# Altium schematic sheet Schematic.SchDoc
size A4; SheetNumber: 1; SheetTotal: 1
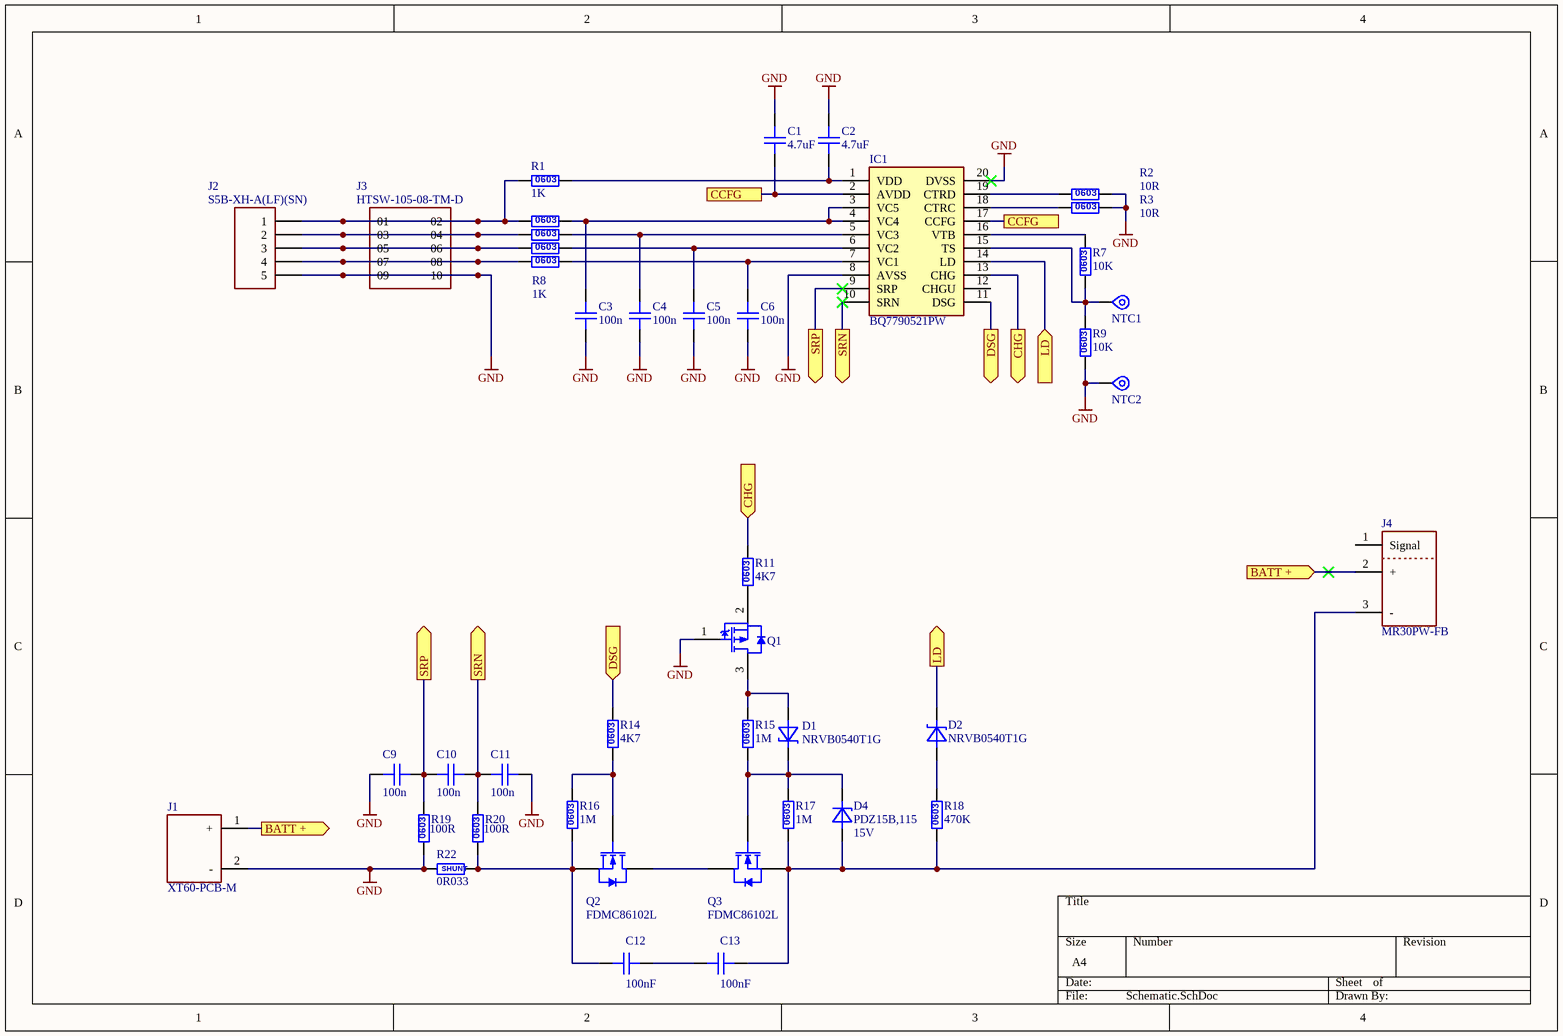
[diagram p0: Schematic.SchDoc]

## Parts
C1  value 4.7uF  [C3216_Commercial]  (hidden comment: GRM31CC72A475ME11L)
C2  value 4.7uF  [C3216_Commercial]  (hidden comment: GRM31CC72A475ME11L)
C3  value 100n  [C0603]  (hidden comment: 06035C104K4Z2A)
C4  value 100n  [C0603]  (hidden comment: 06035C104K4Z2A)
C5  value 100n  [C0603]  (hidden comment: 06035C104K4Z2A)
C6  value 100n  [C0603]  (hidden comment: 06035C104K4Z2A)
C9  value 100n  [C0603]  (hidden comment: 06035C104K4Z2A)
C10  value 100n  [C0603]  (hidden comment: 06035C104K4Z2A)
C11  value 100n  [C0603]  (hidden comment: 06035C104K4Z2A)
C12  value 100nF  [C3216_Commercial]  (hidden comment: GRT31C5C2A104JA12L)
C13  value 100nF  [C3216_Commercial]  (hidden comment: GRT31C5C2A104JA12L)
D1  NRVB0540T1G  [SOD323]
D2  NRVB0540T1G  [SOD323]
D4  PDZ15B,115  value 15V  [SOD323]
IC1  BQ7790521PW  [SOP65P640X120-20N]
J1  XT60-PCB-M  [XT60-PCB-M]
J2  S5B-XH-A(LF)(SN)  [JST_S5B-XH-A(LF)(SN)]
J3  HTSW-105-08-TM-D  [SAMTEC_HTSW-105-08-TM-D]
J4  MR30PW-FB  [MR30PW-FB]
NTC1  TP  [Pad0.8mm MPoint big]  (value not drawn)  (no BOM)
NTC2  TP  [Pad0.8mm MPoint big]  (value not drawn)  (no BOM)
Q1  FDV304P  [FAIR-SOT23-3_V]  (value not drawn)
Q2  FDMC86102L  [PowerPak1212_LFPAK33]
Q3  FDMC86102L  [PowerPak1212_LFPAK33]
R1  value 1K  [R0603]  (hidden comment: ERJ-3EKF1002V)
R2  value 10R  [R0603]  (hidden comment: CR0603-FX-10R0ELF)
R3  value 10R  [R0603]  (hidden comment: CR0603-FX-10R0ELF)
R4  ERJ-3EKF1002V  [R0603]  (value not drawn)
R5  ERJ-3EKF1002V  [R0603]  (value not drawn)
R6  ERJ-3EKF1002V  [R0603]  (value not drawn)
R7  value 10K  [R0603]  (hidden comment: CRGP0603F10K)
R8  value 1K  [R0603]  (hidden comment: ERJ-3EKF1002V)
R9  value 10K  [R0603]  (hidden comment: CRGP0603F10K)
R11  value 4K7  [R0603]  (hidden comment: RC0603FR-074K7L)
R14  value 4K7  [R0603]  (hidden comment: RC0603FR-074K7L)
R15  value 1M  [R0603]  (hidden comment: RC0603JR-071ML)
R16  value 1M  [R0603]  (hidden comment: RC0603JR-071ML)
R17  value 1M  [R0603]  (hidden comment: RC0603JR-071ML)
R18  value 470K  [R0603]  (hidden comment: CRGCQ0603F470K)
R19  value 100R  [R0603]  (hidden comment: RC0603FR-07100RL)
R20  value 100R  [R0603]  (hidden comment: RC0603FR-07100RL)
R22  value 0R033  [Shunt_2512]  (hidden comment: GMR100HTBFMR033)

## Ports
BATT + (in, see Schematic[1D]), BATT + (out, see Schematic[4C]), CCFG (see Schematic[2A]), CCFG (see Schematic[3A]), CHG (in, see Schematic[3B]), CHG (out, see Schematic[2C]), DSG (in, see Schematic[3B]), DSG (out, see Schematic[2C]), LD (in, see Schematic[3C]), LD (out, see Schematic[3B]), SRN (out, see Schematic[2C]), SRN (out, see Schematic[3B]), SRP (out, see Schematic[2C]), SRP (out, see Schematic[3B])

## Nets
GND: C1.2 C2.2 C3.1 C4.1 C5.1 C6.1 C9.1 C11.2 IC1.8(AVSS) IC1.20(DVSS) J1.2(-) J2.5 J3.09 J3.10 NTC2.1 Q1.1(G) R2.1 R3.1 R9.2 R19.2 R22.1
BATT +: J1.1(+) J4.2(+) ; port BATT +
CCFG: C1.1 IC1.2(AVDD) IC1.17(CCFG) ; port CCFG
CHG: IC1.13(CHG) R11.1 ; port CHG
DSG: IC1.11(DSG) R14.1 ; port DSG
LD: D2.2(C) IC1.14(LD) ; port LD
SRN: C10.2 C11.1 IC1.10(SRN) R20.1 ; port SRN
SRP: C9.2 C10.1 IC1.9(SRP) R19.1 ; port SRP
NetC2_1: C2.1 IC1.1(VDD) R1.1
NetC3_2: C3.2 IC1.3(VC5) IC1.4(VC4) R8.1
NetC4_2: C4.2 IC1.5(VC3) R4.1
NetC5_2: C5.2 IC1.6(VC2) R5.1
NetC6_2: C6.2 IC1.7(VC1) R6.1
NetC12_1: C12.1 Q2.1(SOURCE) Q2.2(SOURCE) Q2.3(SOURCE) R16.2 R20.2 R22.2
NetC12_2: C12.2 C13.1
NetC13_2: C13.2 D4.1(A) J4.3(-) Q3.1(SOURCE) Q3.2(SOURCE) Q3.3(SOURCE) R17.2 R18.2
NetD1_1: D1.1(A) Q1.3(D) R15.1
NetD1_2: D1.2(C) D4.2(C) Q3.4(GATE) R15.2 R17.1
NetD2_1: D2.1(A) R18.1
NetIC1_15: IC1.15(TS) NTC1.1 R7.2 R9.1
NetIC1_16: IC1.16(VTB) R7.1
NetIC1_18: IC1.18(CTRC) R3.2
NetIC1_19: IC1.19(CTRD) R2.2
NetJ2_1: J2.1 J3.01 J3.02 R1.2 R8.2
NetJ2_2: J2.2 J3.03 J3.04 R4.2
NetJ2_3: J2.3 J3.05 J3.06 R5.2
NetJ2_4: J2.4 J3.07 J3.08 R6.2
NetQ1_2: Q1.2(S) R11.2
NetQ2_4: Q2.4(GATE) R14.2 R16.1
NetQ2_5: Q2.5(DRAIN) Q3.5(DRAIN)

Not connected (* = marked no-connect by the designer): IC1 12(CHGU); J4 1(Signal)

## Notes on the sheet
- (in symbol CR_0603_100) 0603
- (in symbol CR_0603_101) 0603
- (in symbol CR_0603_102) 0603
- (in symbol CR_0603_103) 0603
- (in symbol CR_0603_105) 0603
- (in symbol CR_0603_472) 0603
- (in symbol CR_0603_474) 0603
- (in symbol SHUNT_2512_0R033) SHUNT

## Library data of the parts
C1 C2 = CC_1206_X7S_475: Capacitor X7S; Supplier 1: Mouser; Supplier 2: Digi-Key; Supplier Part Number 1: 81-GRM31CC72A475ME11; Supplier Part Number 2: 490-18621-6-ND
C3-C6 C9-C11 = CC_0603_X7R_104: Ceramic Capacitor X7R 50V; Part Number: 100n/50V X7R C0603; SMD/THD: SMD; Main: Capacitors; Status: A; Category: Capacitors CERA SMD; Manufacturer Part Number: 100n/50V X7R C0603; Component Type: Capacitors; Supplier 1: Mouser; Supplier 2: Farnell; Supplier Part Number 1: 581-06035C104K4Z2A; Supplier Part Number 2: 1833843
C12 C13 = CC_1206_NP0_104: Capacitor NP0; Supplier 1: Mouser; Supplier 2: Digi-Key; Supplier Part Number 1: 81-GRT31C5C2A104JA2L; Supplier Part Number 2: 490-GRT31C5C2A104JA12LDKR-ND
D1 D2 = NRVB0540T1G: Schottky Diode 40V, 500mA; SMD/THD: SMD; Main: Diodes; Value: NRVB0540T1G; Category: Schottky; Status: A; Supplier 1: Mouser; Supplier Part Number 1: 863-NRVB0540T1G; Supplier 2: Farnell; Supplier Part Number 2: 2723913
D4 = PDZ15B,115: Zener Diode 15V, 400mW; SMD/THD: SMD; Main: Diodes; Category: Zener; Status: A; Supplier 1: Mouser; Supplier Part Number 1: 771-PDZ15B-T/R; Supplier 2: Farnell; Supplier Part Number 2: 1757852; Supplier 3: TME; Supplier Part Number 3: PDZ15B.115
IC1 = BQ7790521PW: 3- to 5-series Li-Ion stackable battery protector; Manufacturer_Name: Texas Instruments; Datasheet Link: https://www.ti.com/lit/ds/symlink/bq77905.pdf?ts=1621687207060&ref_url=https%253A%252F%252Fwww.ti.com%252Fstore%252Fti%252Fen%252Fp%252Fproduct%252F%253Fp%253DBQ7790521PW; Height: 1.2mm; Manufacturer_Part_Number: BQ7790521PW; Mouser Part Number: 595-BQ7790521PW; Mouser Price/Stock: https://www.mouser.co.uk/ProductDetail/Texas-Instruments/BQ7790521PW?qs=bAKSY%2FctAC4iC2ww%2F8Jy9A%3D%3D; Supplier 1: Mouser; Supplier Part Number 1: 595-BQ7790521PWR; Supplier 2: Digi-Key; Supplier Part Number 2: 296-BQ7790521PWRCT-ND; Supplier 3: Texas Instruments; Supplier Part Number 3: BQ7790521PWR
J1 = XT60-PCB-M: XT60 Connector; Manufacturer_Name: Amass; Manufacturer_Part_Number: XT30PB; Datasheet Link: https://www.tme.eu/Document/4acc913878197f8c2e30d4b8cdc47230/XT30UPB%20SPEC.pdf; Height: 10.7mm
J2 = S5B-XH-A(LF)(SN): Connector Header Through Hole, Right Angle 5 position 0.098 _2.50mm_; MF: JST Sales; MP: S5B-XH-A_LF__SN_; SnapEDA_Link: https://www.snapeda.com/parts/S5B-XH-A%28LF%29%28SN%29/JST%20Sales%20America%20Inc./view-part/494428/?ref=snap; Price: None; Package: None; Availability: Unavailable; Value: *
J3 = HTSW-105-08-TM-D: HEADER, 10 CONTACTS, 2 ROWS, THROUGH HOLE, 2.54 MM; Connector Systems:Board-to-Board; Pitch Spacing:2.54mm; No. of Rows:2Rows; No. of Contacts:10Contacts; Contact Termination Type:Through Hole; Product Range:HTSW Series RoHS Compliant: Yes; MP: HTSW10508TMD; MF: Samtec; Price: None; SnapEDA_Link: https://www.snapeda.com/parts/HTSW10508TMD/Samtec/view-part/?ref=snap; Check_prices: https://www.snapeda.com/parts/HTSW10508TMD/Samtec/view-part/?ref=eda; Package: None; Availability: In Stock; Value: *
J4 = MR30PW-FB: Connector; Supplier 1: TME; Supplier Part Number 1: MR30PW-FB
NTC1 NTC2 = TP_PCB: Test Point; Main: Mechanical; Category: Pads_Pins_Measure_Points; Stock number: --------; Component Type: Mechanical
Q1 = FDV304P: P-Channel Digital FET, -25 V, -0.46 A, 0.35 W, -55 to 150 degC, 3-Pin SOT-23, -55 to 150 degC, RoHS, Tape and Reel; Manufacturer: ON Semiconductor / Fairchild; Rad Hard: No; Typical Fall Time: 35ns; Typical Rise Time: 8ns; Channel Mode: Enhancement; Maximum Continuous Drain Current: 0.46A; RDS-on: 1100@4.5VmOhm; Maximum Drain Source Voltage: 25V; Package Version: Rev. 12, 03/2016; Typical Turn-On Delay Time: 6ns; Maximum Gate Source Voltage: 8V; Channel Type: P; Typical Turn-Off Delay Time: 55ns; Datasheet Version: Rev. E1, 08/1997; Package Description: 3-Pin Small Outline Transistor, Body 2.92 x 1.325 mm, Pitch 0.95 mm; Operating Temperature: -55to150°C; Package Reference: SOT23-3; Manufacturer URL: https://www.fairchildsemi.com/; Package URL: http://www.fairchildsemi.com/dwg/MA/MA03D.pdf; Package: 3SOT-23; Category: MOSFET; Packaging: Tape&Reel; Mounting: SurfaceMount; Datasheet URL: https://www.fairchildsemi.com/datasheets/FD/FDV304P.pdf; Mounting Technology: SurfaceMount; Manufacturer Part Number: FDV304P; Supplier 1: Digi-Key; Supplier 2: Digi-Key; Supplier Part Number 2: FDV304PDKR-ND; Supplier Part Number 1: FDV304PCT-ND
Q2 Q3 = FDMC86102L: N-MOS 100V, 18A, 23mOhm; Manufacturer: ON Semiconductor / Fairchild; Main: Transistors; SMD/THD: SMD; Category: N-MOS; Value: FDMC86102L; ComponentLink1Description: Datasheet; ComponentLink1URL: http://www.farnell.com/datasheets/1837750.pdf; Status: A; Part Number: FDMC86102L; Manufacturer Part Number: FDMC86102L; Component Type: Transistors
R1 R8 = CR_0603_102: Resistor 1%, 0.1W, 75V; SMD/THD: SMD; Main: Resistors; Status: A; Category: Resistors SMD; Component Type: Resistors; Supplier 1: Mouser; Supplier 2: Digi-Key; Supplier 3: Farnell; Supplier Part Number 1: 667-ERJ-3EKF1002V; Supplier Part Number 2: P10.0KHCT-ND; Supplier Part Number 3: 2303192
R2 R3 = CR_0603_100: Resistor 1%, 0.1W, 75V; SMD/THD: SMD; Main: Resistors; Status: A; Category: Resistors SMD; Component Type: Resistors; Supplier 1: Mouser; Supplier 2: Farnell; Supplier 3: Digi-Key; Supplier Part Number 2: 2321756; Supplier Part Number 1: 652-CR0603FX-10R0ELF; Supplier Part Number 3: CR0603-FX-10R0ELFDKR-ND
R4-R6 = CR_0603_102: Resistor 1%, 0.1W, 75V; SMD/THD: SMD; Main: Resistors; Value: 1K; Status: A; Category: Resistors SMD; Component Type: Resistors; Supplier 1: Mouser; Supplier 2: Digi-Key; Supplier 3: Farnell; Supplier Part Number 1: 667-ERJ-3EKF1002V; Supplier Part Number 2: P10.0KHCT-ND; Supplier Part Number 3: 2303192
R7 R9 = CR_0603_103: Resistor 1%, 0.1W, 75V; SMD/THD: SMD; Main: Resistors; Status: A; Category: Resistors SMD; Component Type: Resistors; Supplier 1: Mouser; Supplier 2: Digi-Key; Supplier 3: Farnell; Supplier Part Number 3: 2861046; Supplier Part Number 2: A130428CT-ND; Supplier Part Number 1: 279-CRGP0603F10K
R11 R14 = CR_0603_472: Resistor 1%, 0.1W, 75V; SMD/THD: SMD; Main: Resistors; Status: A; Category: Resistors SMD; Component Type: Resistors; Supplier 1: Mouser; Supplier 2: Farnell; Supplier 3: TME; Supplier Part Number 1: 603-RC0603FR-074K7L; Supplier Part Number 2: 9238565; Supplier Part Number 3: RC0603FR-074K7
R15-R17 = CR_0603_105: Resistor 1%, 0.1W, 75V; Part Number: 1M0 R0603; SMD/THD: SMD; Main: Resistors; Status: A; Category: Resistors SMD; Manufacturer Part Number: 1M0 R0603; Component Type: Resistors; Supplier 1: Mouser; Supplier 2: TME; Supplier 3: Digi-Key; Supplier Part Number 2: RC0603JR-071M; Supplier Part Number 1: 603-RC0603JR-071ML; Supplier Part Number 3: 311-1.0MGRCT-ND
R18 = CR_0603_474: Resistor 1%, 0.1W, 75V; SMD/THD: SMD; Main: Resistors; Status: A; Category: Resistors SMD; Component Type: Resistors; Supplier 1: Mouser; Supplier 2: Digi-Key; Supplier 3: TME; Supplier Part Number 2: A129720CT-ND; Supplier Part Number 1: 279-CRGCQ0603F470K; Supplier Part Number 3: CRGCQ0603F470K
R19 R20 = CR_0603_101: Resistor 1%, 0.1W, 75V; SMD/THD: SMD; Main: Resistors; Status: A; Category: Resistors SMD; Component Type: Resistors; Supplier 1: Mouser; Supplier 2: Farnell; Supplier 3: TME; Supplier Part Number 1: 603-RC0603FR-07100RL; Supplier Part Number 3: RC0603FR-07100R; Supplier Part Number 2: 9238360
R22 = SHUNT_2512_0R033: Current Sense Resistor 1%, 3W, AEC-Q200; SMD/THD: SMD; Main: Resistors; Status: A; Category: Resistors SMD; Component Type: Resistors; Supplier 1: Mouser; Supplier Part Number 1: 755-GMR100HTBFMR033; Supplier 2: Digi-Key; Supplier Part Number 2: 511-1690-1-ND; Supplier 3: Farnell; Supplier Part Number 3: 2808333